# EAGLE design md_v02 (EAGLE 9.0.1)
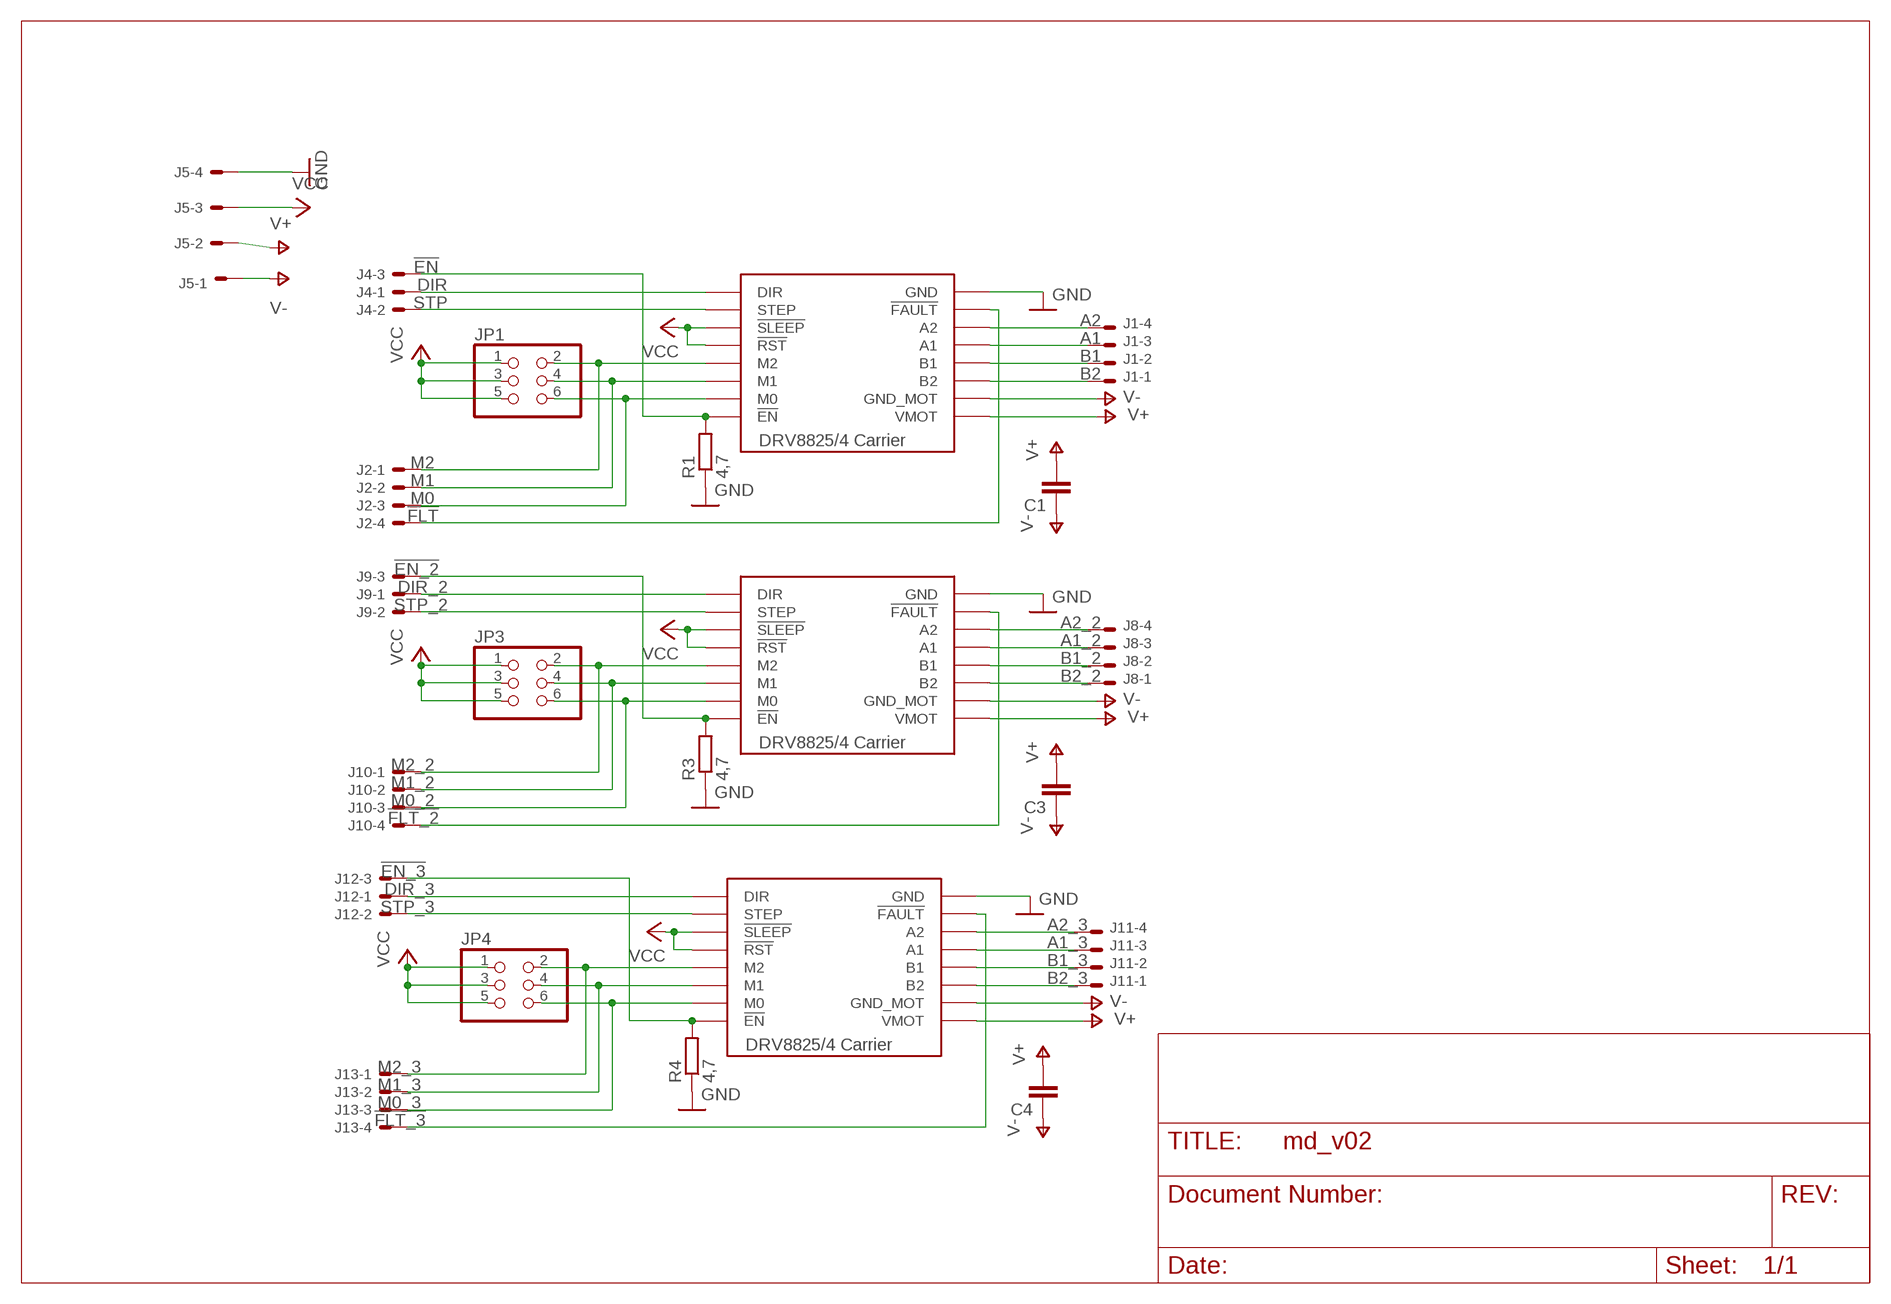
[diagram p0: schematic, sheet 1]

## Parts
C1  C-EU050-035X075  [C050-035X075]
C3  C-EU050-035X075  [C050-035X075]
C4  C-EU050-035X075  [C050-035X075]
J1  22-27-2041-04  [6410-04]
J2  22-27-2041-04  [6410-04]
J4  22-27-2031-03  [6410-03]
J5  22-27-2041-04  [6410-04]
J8  22-27-2041-04  [6410-04]
J9  22-27-2031-03  [6410-03]
J10  22-27-2041-04  [6410-04]
J11  22-27-2041-04  [6410-04]
J12  22-27-2031-03  [6410-03]
J13  22-27-2041-04  [6410-04]
JP1  PINHD-2X3  [2X03]
JP3  PINHD-2X3  [2X03]
JP4  PINHD-2X3  [2X03]
M1  DRV8825_CARRIER"  [DRV882_CARRIER]
M3  DRV8825_CARRIER"  [DRV882_CARRIER]
M4  DRV8825_CARRIER"  [DRV882_CARRIER]
R1  4,7  R-EU_0204/7  [0204/7]
R3  4,7  R-EU_0204/7  [0204/7]
R4  4,7  R-EU_0204/7  [0204/7]

## Nets
!EN: J4.3 M1.EN(!EN) R1.2
!EN_2: J9.3 M3.EN(!EN) R3.2
!EN_3: J12.3 M4.EN(!EN) R4.2
!FLT: J2.4 M1.!FLT(!FAULT)
!FLT_2: J10.4 M3.!FLT(!FAULT)
!FLT_3: J13.4 M4.!FLT(!FAULT)
A1: J1.3 M1.A1
A1_2: J8.3 M3.A1
A1_3: J11.3 M4.A1
A2: J1.4 M1.A2
A2_2: J8.4 M3.A2
A2_3: J11.4 M4.A2
B1: J1.2 M1.B1
B1_2: J8.2 M3.B1
B1_3: J11.2 M4.B1
B2: J1.1 M1.B2
B2_2: J8.1 M3.B2
B2_3: J11.1 M4.B2
DIR: J4.1 M1.DIR
DIR_2: J9.1 M3.DIR
DIR_3: J12.1 M4.DIR
GND: J5.4 M1.GND M3.GND M4.GND R1.1 R3.1 R4.1
M0: J2.3 JP1.6 M1.M0
M0_2: J10.3 JP3.6 M3.M0
M0_3: J13.3 JP4.6 M4.M0
M1: J2.2 JP1.4 M1.M1
M1_2: J10.2 JP3.4 M3.M1
M1_3: J13.2 JP4.4 M4.M1
M2: J2.1 JP1.2 M1.M2
M2_2: J10.1 JP3.2 M3.M2
M2_3: J13.1 JP4.2 M4.M2
STP: J4.2 M1.STEP
STP_2: J9.2 M3.STEP
STP_3: J12.2 M4.STEP
V+: C1.2 C3.2 C4.2 J5.2 M1.VMOT M3.VMOT M4.VMOT
V-: C1.1 C3.1 C4.1 J5.1 M1.GND_MOT M3.GND_MOT M4.GND_MOT
VCC: J5.3 JP1.1 JP1.3 JP1.5 JP3.1 JP3.3 JP3.5 JP4.1 JP4.3 JP4.5 M1.RST(!RST) M1.SLP(!SLEEP) M3.RST(!RST) M3.SLP(!SLEEP) M4.RST(!RST) M4.SLP(!SLEEP)

## Library data of the parts
C1 C3 C4 = rcl:C-EU: CAPACITOR, European symbol; SPICEPREFIX: C
J1 J2 J5 J8 J10 J11 J13 = con-molex:22-?-04: CONNECTOR wire to board 2.54 mm (.1 inch) pitch header; MF: MOLEX; OC_FARNELL: unknown; OC_NEWARK: unknown
J4 J9 J12 = con-molex:22-?-03: CONNECTOR wire to board 2.54 mm (.1 inch) pitch header; MF: MOLEX; OC_FARNELL: unknown; OC_NEWARK: unknown
JP1 JP3 JP4 = pinhead:PINHD-2X3: PIN HEADER
M1 M3 M4 = RepRapjr:DRV8825_CARRIER
R1 R3 R4 = rcl:R-EU_: RESISTOR, European symbol; SPICEPREFIX: R

## Board
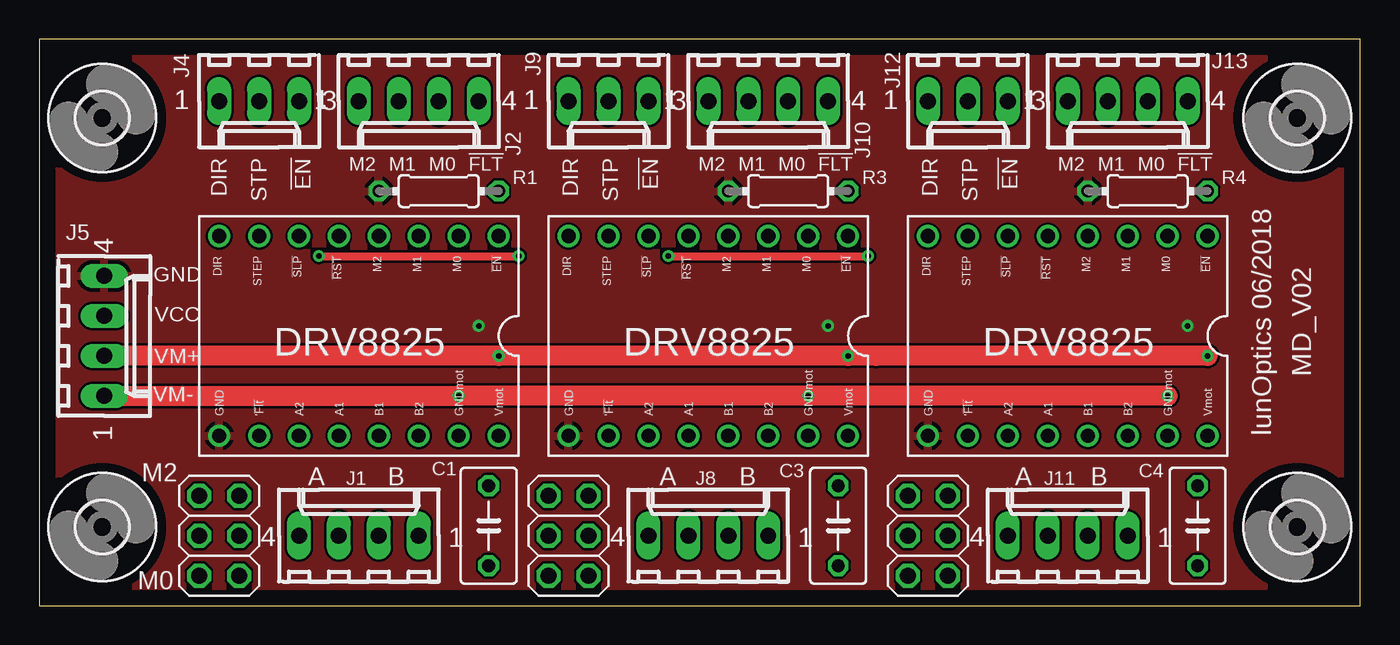
[diagram p1: board, top side]
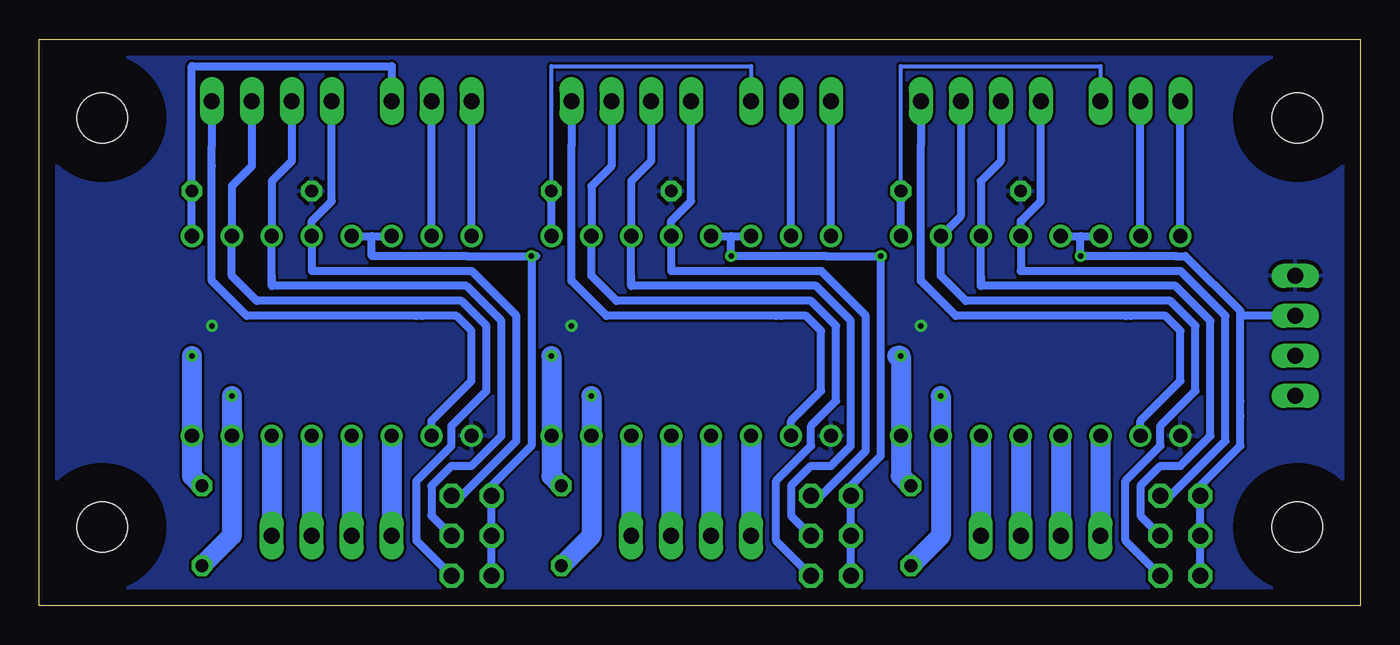
[diagram p2: board, bottom side, seen from below]

Size 84 x 36 mm. Coordinates in mm from the lower left corner, seen from the top.
Outline: 0,0 84,0 84,36 0,36 0,0
Copper layers (1*16): Top 0.035mm / dielectric 1.5mm / Bottom 0.035mm
Design rules "default *": minimum track width 6mil, minimum drill 0.35mm, track to track 6mil, track to pad 6mil, pad to pad 6mil, via to via 6mil, smd to smd 6mil, copper to edge 40mil, drill to drill 6mil, minimum pad ring 10mil, minimum via ring 8mil, stop-mask expansion 4mil, vias tented up to drill 0mil, thermal gap 10mil

### Footprints (pad centres in the part's own frame; a part is rotated, then mirrored left to right if it is on the bottom)
C050-035X075 = drill 0.813 octagon: 1 -2.54,0; 2 2.54,0
6410-04 = drill 1.016 long: 1 3.81,0; 2 1.27,0; 3 -1.27,0; 4 -3.81,0
6410-03 = drill 1.016 long: 1 2.54,0; 2 0,0; 3 -2.54,0
2X03 = drill 1.016 octagon: 1 -2.54,-1.27; 2 -2.54,1.27; 3 0,-1.27; 4 0,1.27; 5 2.54,-1.27; 6 2.54,1.27
DRV882_CARRIER = drill 0.9: !FLT 6.35,6.35; A1 1.27,6.35; A2 3.81,6.35; B1 -1.27,6.35; B2 -3.81,6.35; DIR 8.89,-6.35; EN -8.89,-6.35; GND 8.89,6.35; GND_MOT -6.35,6.35; M0 -6.35,-6.35; M1 -3.81,-6.35; M2 -1.27,-6.35; RST 1.27,-6.35; SLP 3.81,-6.35; STEP 6.35,-6.35; VMOT -8.89,6.35
0204/7 = drill 0.813 octagon: 1 -3.81,0; 2 3.81,0
3,2 = hole 3.2: 0,0

### Placement (x,y rotation side)
C1  28.57,5.08 90 top
C3  50.8,5.08 90 top
C4  73.66,5.08 90 top
J1  20.32,4.45 0 top
J2  24.13,32.07 180 top
J4  13.97,32.07 180 top
J5  4.13,17.14 270 top
J8  42.55,4.45 0 top
J9  36.2,32.07 180 top
J10  46.35,32.07 180 top
J11  65.41,4.45 0 top
J12  59.05,32.07 180 top
J13  69.22,32.07 180 top
JP1  11.43,4.45 270 top
JP3  33.66,4.45 270 top
JP4  56.52,4.45 270 top
M1  20.32,17.14 180 top
M3  42.55,17.14 180 top
M4  65.41,17.14 180 top
R1  25.4,26.35 0 top
R3  47.62,26.35 0 top
R4  70.48,26.35 0 top
U$1  [3,2]  4,5 0 top
U$2  [3,2]  4,31 0 top
U$3  [3,2]  80,31 0 top
U$4  [3,2]  80,5 0 top

### Tracks (layer width: path | path; a pad name or v marks a point on that pad's centre or on a via)
!EN
  Bottom 0.254: J4.3 16.51,34.29 29.21,34.29 R1.2
  Bottom 0.508: M1.EN R1.2
!EN_2
  Bottom 0.254: J9.3 38.73,34.29 51.44,34.29 R3.2
  Bottom 0.508: M3.EN R3.2
!EN_3
  Bottom 0.508: M4.EN R4.2 74.3,34.29 61.59,34.29 J12.3
!FLT
  Bottom 0.508: J2.4 27.94,29.21 27.94,27.94 27.94,20.64 25.72,18.41 14.92,18.41 | 14.55,18.41 14.92,18.41 | M1.!FLT 13.97,11.75 11.43,14.29 11.43,17.46 12.38,18.41 14.92,18.41
!FLT_2
  Bottom 0.508: J10.4 50.16,29.21 50.16,27.94 50.16,20.64 47.94,18.41 37.15,18.41 | 36.78,18.41 37.15,18.41 | M3.!FLT 36.2,11.75 34.29,13.65 34.29,17.46 35.24,18.41 37.15,18.41
!FLT_3
  Bottom 0.508: J13.4 73.03,29.21 73.03,27.94 73.03,20.64 70.8,18.41 60.01,18.41 | 59.64,18.41 60.01,18.41 | M4.!FLT 59.05,11.75 56.52,14.29 56.52,17.46 57.47,18.41 60.01,18.41
A1
  Bottom 1.27: M1.A1 J1.3
A1_2
  Bottom 1.27: M3.A1 J8.3
A1_3
  Bottom 1.27: M4.A1 J11.3
A2
  Bottom 1.27: M1.A2 J1.4
A2_2
  Bottom 1.27: M3.A2 J8.4
A2_3
  Bottom 1.27: M4.A2 J11.4
B1
  Bottom 1.27: M1.B1 J1.2
B1_2
  Bottom 1.27: M3.B1 J8.2
B1_3
  Bottom 1.27: M4.B1 J11.2
B2
  Bottom 1.27: M1.B2 J1.1
B2_2
  Bottom 1.27: M3.B2 J8.1
B2_3
  Bottom 1.27: M4.B2 J11.1
DIR
  Bottom 0.508: M1.DIR J4.1
DIR_2
  Bottom 0.508: M3.DIR J9.1
DIR_3
  Bottom 0.508: M4.DIR J12.1
GND  (via drill 0.35)
  other vias: 27.94,17.78 50.16,17.78 73.03,17.78
  pour Top: -4.5,-3 95.5,-3 95.33,40.29 -5,39.5
  pour Bottom: -2.54,38.1 93.98,38.1 93.98,-2.54 -5.08,-2.54 -5.08,38.1
M0
  Bottom 0.508: J2.3 25.4,24.77 M1.M0 26.67,20.95 25.08,19.37 12.06,19.37 10.48,17.78 10.48,13.65 12.7,11.43 12.7,10.16 14.92,7.94 14.92,4.13 JP1.6
M0_2
  Bottom 0.508: J10.3 47.62,27.94 48.9,26.67 M3.M0 48.9,20.95 47.31,19.37 34.92,19.37 33.34,17.78 33.34,13.02 34.92,11.43 34.92,10.16 37.15,7.94 37.15,4.13 JP3.6
M0_3
  Bottom 0.508: J13.3 70.48,27.94 71.75,26.67 M4.M0 71.75,20.95 70.17,19.37 57.15,19.37 55.56,17.78 55.56,13.65 57.78,11.43 57.78,10.16 60.01,7.94 60.01,4.13 JP4.6
M1
  Bottom 0.508: JP1.4 13.97,5.71 13.97,7.62 12.7,8.89 11.43,8.89 9.53,10.79 9.53,18.1 11.75,20.32 24.13,20.32 | 24.13,20.32 24.13,20.95 | 24.13,20.95 24.13,20.32 | 24.13,20.32 24.13,20.95 | 24.13,20.95 M1.M1 24.13,26.99 22.86,28.26 J2.2
M1_2
  Bottom 0.508: JP3.4 36.2,5.71 36.2,7.62 34.92,8.89 33.66,8.89 32.38,10.16 32.38,12.7 32.38,18.1 34.61,20.32 46.35,20.32 | 46.35,20.32 46.35,20.95 | 46.35,20.95 46.35,20.32 | 46.35,20.32 46.35,20.95 | 46.35,20.95 M3.M1 46.35,26.99 45.09,28.26 J10.2
M1_3
  Bottom 0.508: JP4.4 59.05,5.71 59.05,7.62 57.78,8.89 56.52,8.89 54.61,10.79 54.61,18.1 56.83,20.32 69.22,20.32 | 69.22,20.32 69.22,20.95 | 69.22,20.95 69.22,20.32 | 69.22,20.32 69.22,20.95 | 69.22,20.95 M4.M1 69.22,26.99 67.94,28.26 J13.2
M2
  Bottom 0.508: J2.1 20.32,25.72 21.59,24.45 M1.M2 21.59,21.27 11.43,21.27 8.57,18.41 8.57,10.48 12.06,6.99 JP1.2
M2_2
  Bottom 0.508: J10.1 42.55,25.72 43.81,24.45 M3.M2 43.81,21.27 34.29,21.27 31.43,18.41 31.43,9.84 34.29,6.99 JP3.2
M2_3
  Bottom 0.508: J13.1 65.41,25.72 66.67,24.45 M4.M2 66.67,21.27 56.52,21.27 53.66,18.41 53.66,10.48 57.15,6.99 JP4.2
STP
  Bottom 0.508: M1.STEP J4.2
STP_2
  Bottom 0.508: M3.STEP J9.2
STP_3
  Bottom 0.508: M4.STEP J12.2
V+  (via drill 0.35)
  Top 1.27: J5.2 v29.21,15.88 v51.44,15.88 53.21,15.88 v74.3,15.88
  Bottom 1.27: C1.2 28.89,7.94 29.21,8.26 M1.VMOT v29.21,15.88 | C3.2 51.12,7.94 51.44,8.26 M3.VMOT v51.44,15.88 | v29.21,15.88 29.44,15.88 v29.21,15.88 | C4.2 73.98,7.94 74.3,8.26 M4.VMOT v74.3,15.88
V-  (via drill 0.35)
  Top 1.27: J5.1 v26.67,13.34 v48.9,13.34 v71.75,13.34
  Bottom 1.27: C1.1 26.67,4.45 M1.GND_MOT v26.67,13.34 | C3.1 48.9,4.45 M3.GND_MOT v48.9,13.34 | C4.1 71.75,4.45 M4.GND_MOT v71.75,13.34
VCC  (via drill 0.35)
  Top 0.508: v17.78,22.23 v30.48,22.23 | v40.01,22.23 v52.7,22.23
  Bottom 0.508: M1.RST 17.78,23.5 | 17.78,23.5 M1.SLP | JP1.5 JP1.3 JP1.1 10.16,7.62 7.62,10.16 7.62,12.06 7.62,13.02 7.62,18.41 | 7.62,18.41 7.62,18.73 11.11,22.23 11.75,22.23 v17.78,22.23 17.78,23.5 | J5.3 7.62,18.41 | M3.RST 40.01,23.5 | 40.01,23.5 M3.SLP | JP3.5 JP3.3 JP3.1 32.38,7.62 30.48,9.53 30.48,19.05 v30.48,22.23 33.97,22.23 v40.01,22.23 40.01,23.5 | M4.RST 62.87,23.5 | 62.87,23.5 M4.SLP | v52.7,22.23 56.83,22.23 62.87,22.23 62.87,23.5 | v52.7,22.23 52.39,22.23 v52.7,22.23 | JP4.5 JP4.3 JP4.1 55.24,7.62 52.7,10.16 v52.7,22.23

### Text on the board
tPlace: DIR | STP | !EN | M2 | M1 | M0 | !FLT | DIR | STP | !EN | M2 | M1 | M0 | !FLT | DIR | STP | !EN | M2 | M1 | M0 | !FLT | GND | VCC | lunOptics 06/2018 | MD_V02 | DRV8825 | DRV8825 | DRV8825 | VM+ | VM- | M2 | A | B | A | B | A | B | M0